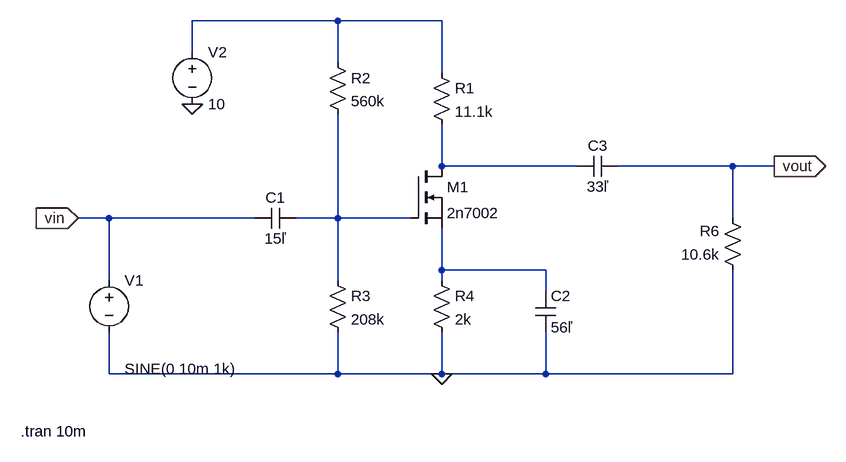
[diagram p0: schematic NNM24EE039_GaganValke.asc]
NNM24EE039_GaganValke.asc, the LTspice schematic file:
Version 4.1
SHEET 1 880 680
WIRE -1472 -288 -1696 -288
WIRE -1312 -288 -1472 -288
WIRE -1696 -240 -1696 -288
WIRE -1472 -224 -1472 -288
WIRE -1312 -208 -1312 -288
WIRE -1312 -64 -1312 -128
WIRE -1104 -64 -1312 -64
WIRE -864 -64 -1040 -64
WIRE -800 -64 -864 -64
WIRE -1824 16 -1872 16
WIRE -1600 16 -1824 16
WIRE -1472 16 -1472 -144
WIRE -1472 16 -1536 16
WIRE -1360 16 -1472 16
WIRE -864 16 -864 -64
WIRE -1312 96 -1312 32
WIRE -1152 96 -1312 96
WIRE -1824 112 -1824 16
WIRE -1472 112 -1472 16
WIRE -1312 112 -1312 96
WIRE -1152 128 -1152 96
WIRE -1824 256 -1824 192
WIRE -1472 256 -1472 192
WIRE -1472 256 -1824 256
WIRE -1312 256 -1312 192
WIRE -1312 256 -1472 256
WIRE -1152 256 -1152 192
WIRE -1152 256 -1312 256
WIRE -864 256 -864 96
WIRE -864 256 -1152 256
FLAG -1696 -160 0
FLAG -1312 256 0
FLAG -800 -64 vout
IOPIN -800 -64 Out
FLAG -1872 16 vin
IOPIN -1872 16 In
SYMBOL res -1328 -224 R0
SYMATTR InstName R1
SYMATTR Value 11.1k
SYMBOL res -1488 -240 R0
SYMATTR InstName R2
SYMATTR Value 560k
SYMBOL res -1488 96 R0
SYMATTR InstName R3
SYMATTR Value 208k
SYMBOL res -1328 96 R0
SYMATTR InstName R4
SYMATTR Value 2k
SYMBOL res -848 112 R180
WINDOW 0 36 76 Left 2
WINDOW 3 36 40 Left 2
SYMATTR InstName R6
SYMATTR Value 10.6k
SYMBOL cap -1536 0 R90
WINDOW 0 0 32 VBottom 2
WINDOW 3 32 32 VTop 2
SYMATTR InstName C1
SYMATTR Value 15ľ
SYMBOL cap -1168 128 R0
SYMATTR InstName C2
SYMATTR Value 56ľ
SYMBOL cap -1040 -80 R90
WINDOW 0 0 32 VBottom 2
WINDOW 3 32 32 VTop 2
SYMATTR InstName C3
SYMATTR Value 33ľ
SYMBOL voltage -1824 96 R0
WINDOW 3 24 152 Left 2
WINDOW 123 24 124 Left 2
WINDOW 39 0 0 Left 0
SYMATTR Value SINE(0 10m 1k)
SYMATTR InstName V1
SYMBOL voltage -1696 -256 R0
WINDOW 123 0 0 Left 0
WINDOW 39 0 0 Left 0
SYMATTR InstName V2
SYMATTR Value 10
SYMBOL nmos -1360 -64 R0
SYMATTR InstName M1
SYMATTR Value 2n7002
TEXT -1960 344 Left 2 !.tran 10m

The netlist it stands for:
* NNM24EE039_GaganValke.asc
R1 N001 N002 11.1k
R2 N001 N003 560k
R3 N003 0 208k
R4 N004 0 2k
R6 0 vout 10.6k
C1 N003 vin 15ľ
C2 N004 0 56ľ
C3 vout N002 33ľ
V1 vin 0 SINE(0 10m 1k)
V2 N001 0 10
M1 N002 N003 N004 N004 2n7002
.model NMOS NMOS
.model PMOS PMOS
.lib standard.mos
.tran 10m
.backanno
.end